# EAGLE design Power Supply Board (EAGLE 9.0.1)
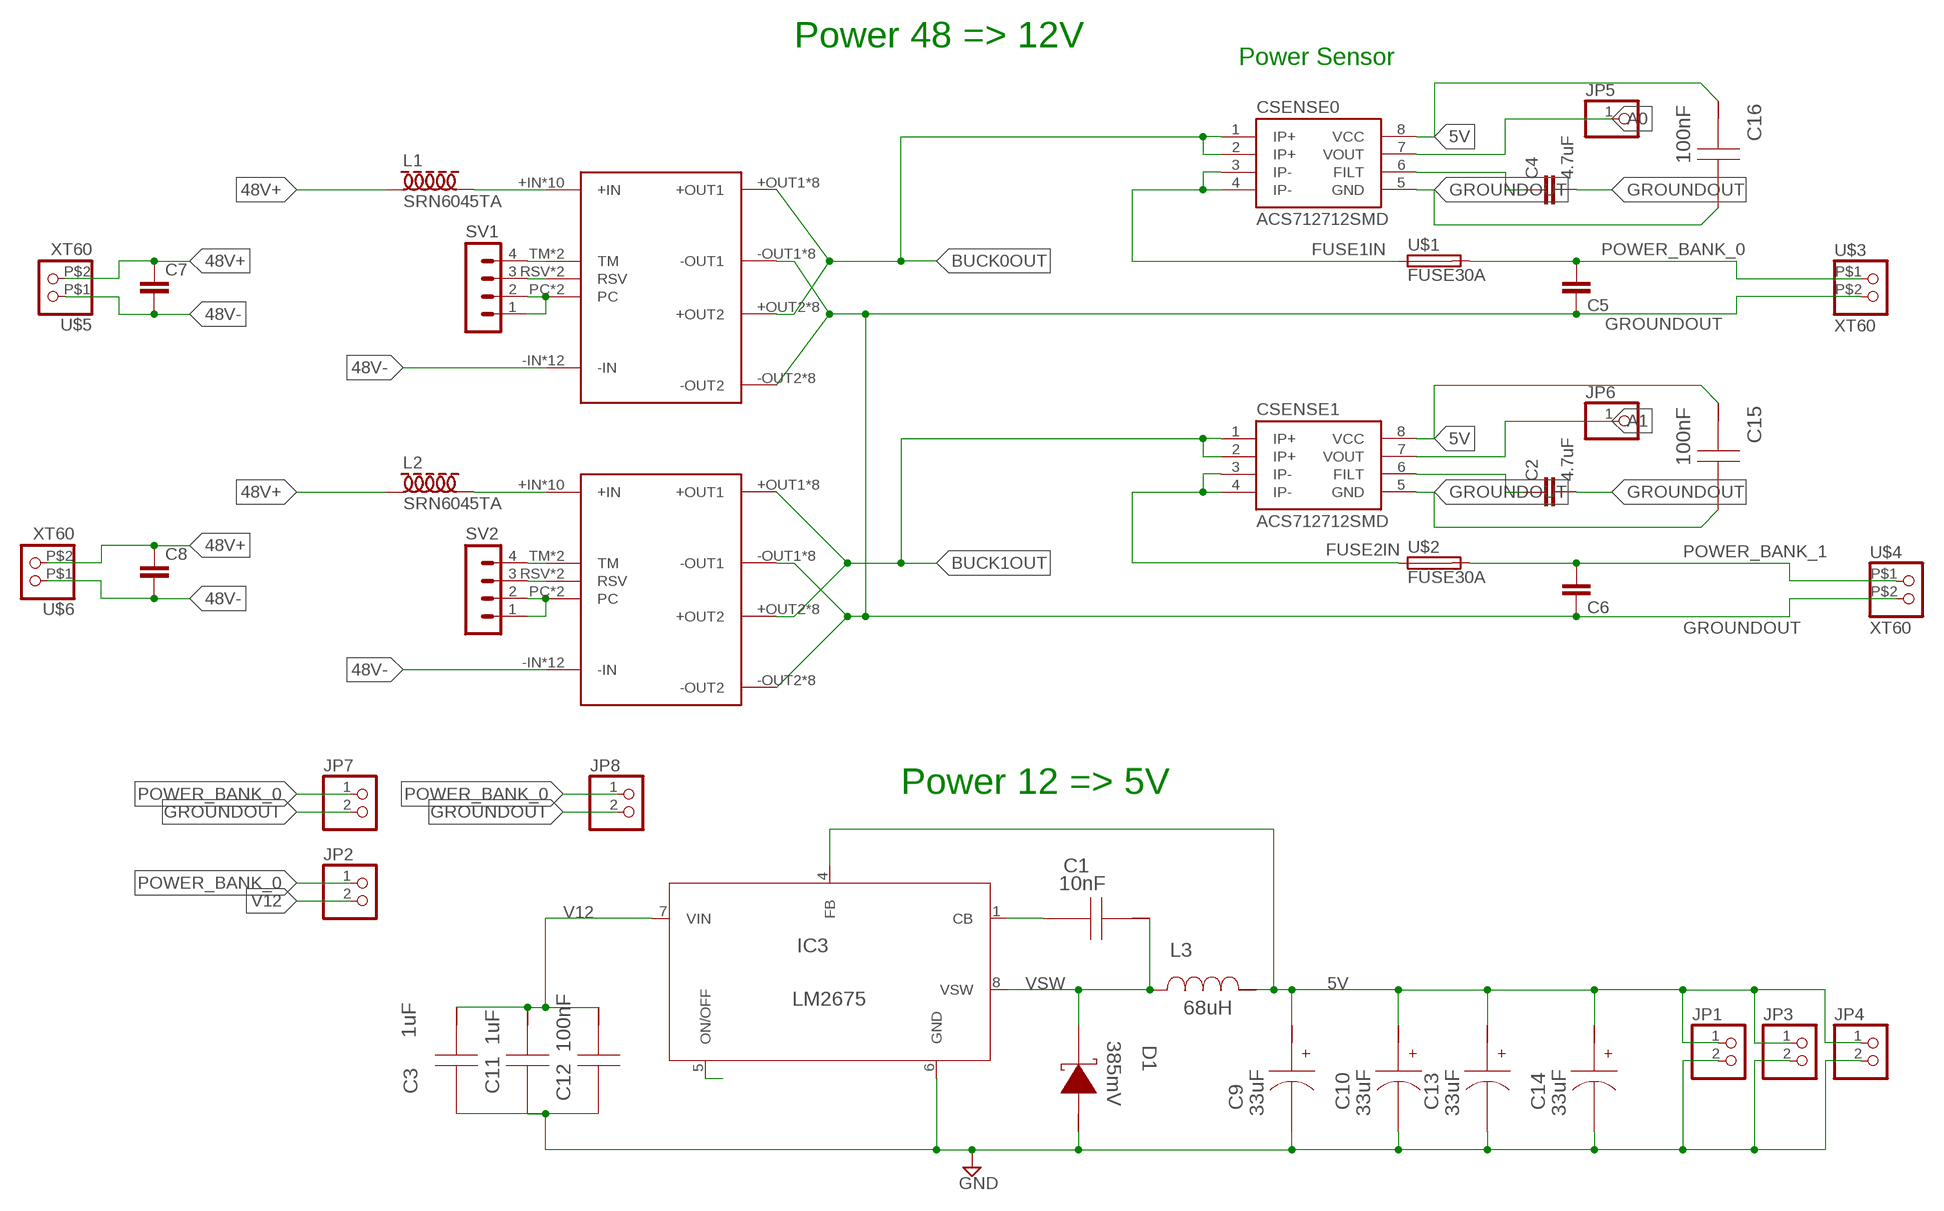
[diagram p0: schematic, sheet 1]

## Parts
C1  10nF  GRM216R71H103KA01D  [0805]
C2  4.7uF  4.7UF-6.3V-10%(0603)0603  [0603-CAP]
C3  1uF  GRM188R61E105KA12D  [0603]
C4  4.7uF  4.7UF-6.3V-10%(0603)0603  [0603-CAP]
C5  C2,5-3  [C2.5-3]
C6  C2,5-3  [C2.5-3]
C7  C2,5-3  [C2.5-3]
C8  C2,5-3  [C2.5-3]
C9  33uF  ATPH33MAHA  [CAPSMT_6_A09]
C10  33uF  ATPH33MAHA  [CAPSMT_6_A09]
C11  1uF  GRM188R61E105KA12D  [0603]
C12  100nF  08053C104KAT2A  [0805]
C13  33uF  ATPH33MAHA  [CAPSMT_6_A09]
C14  33uF  ATPH33MAHA  [CAPSMT_6_A09]
C15  100nF  08053C104KAT2A  [0805]
C16  100nF  08053C104KAT2A  [0805]
CSENSE0  ACS712712SMD  [SO08]
CSENSE1  ACS712712SMD  [SO08]
D1  385mV  MBR0520LT1G  [SOD-123]
IC3  LM2675  LM2675MX-3.3/NOPB  [M08A]
JP1  PINHD-1X2  [1X02]
JP2  PINHD-1X2  [1X02]
JP3  PINHD-1X2  [1X02]
JP4  PINHD-1X2  [1X02]
JP5  PINHD-1X1  [1X01]
JP6  PINHD-1X1  [1X01]
JP7  PINHD-1X2  [1X02]
JP8  PINHD-1X2  [1X02]
L1  SRN6045TA  [SRN6045TA]
L2  SRN6045TA  [SRN6045TA]
L3  68uH  SRU1028-680Y  [SRU1028]
SV1  MA04-1  [MA04-1]
SV2  MA04-1  [MA04-1]
U$1  FUSE30A  [FUSE30A]
U$2  FUSE30A  [FUSE30A]
U$3  XT60  [XT60]
U$4  XT60  [XT60]
U$5  XT60  [XT60]
U$6  XT60  [XT60]
VC1  VOLTAGECONVERTER  [VOLTAGECONVERTER]
VC2  VOLTAGECONVERTER  [VOLTAGECONVERTER]

## Nets
5V: C9.1(+) C10.1(+) C13.1(+) C14.1(+) C15.1 C16.1 CSENSE0.8(VCC) CSENSE1.8(VCC) IC3.4(FB) JP1.1 JP3.1 JP4.1 L3.2
48V+: C7.1 C8.1 L1.P$1 L2.P$1 U$5.P$2 U$6.P$2
48V-: C7.2 C8.2 U$5.P$1 U$6.P$1 VC1.-IN VC1.-IN@0(-IN) VC1.-IN@1(-IN) VC1.-IN@2(-IN) VC1.-IN@3(-IN) VC1.-IN@4(-IN) VC1.-IN@5(-IN) VC1.-IN@6(-IN) VC1.-IN@7(-IN) VC1.-IN@8(-IN) VC1.-IN@9(-IN) VC1.-IN@10(-IN) VC2.-IN VC2.-IN@0(-IN) VC2.-IN@1(-IN) VC2.-IN@2(-IN) VC2.-IN@3(-IN) VC2.-IN@4(-IN) VC2.-IN@5(-IN) VC2.-IN@6(-IN) VC2.-IN@7(-IN) VC2.-IN@8(-IN) VC2.-IN@9(-IN) VC2.-IN@10(-IN)
48VIN1: L1.P$2 VC1.+IN VC1.+IN@1(+IN) VC1.+IN@2(+IN) VC1.+IN@3(+IN) VC1.+IN@4(+IN) VC1.+IN@5(+IN) VC1.+IN@6(+IN) VC1.+IN@7(+IN) VC1.+IN@8(+IN) VC1.+IN@9(+IN)
48VIN2: L2.P$2 VC2.+IN VC2.+IN@1(+IN) VC2.+IN@2(+IN) VC2.+IN@3(+IN) VC2.+IN@4(+IN) VC2.+IN@5(+IN) VC2.+IN@6(+IN) VC2.+IN@7(+IN) VC2.+IN@8(+IN) VC2.+IN@9(+IN)
A0: CSENSE0.7(VOUT) JP5.1
A1: CSENSE1.7(VOUT) JP6.1
BUCK0OUT: CSENSE0.1(IP+) CSENSE0.2(IP+) VC1.+OUT1 VC1.+OUT1@1(+OUT1) VC1.+OUT1@2(+OUT1) VC1.+OUT1@3(+OUT1) VC1.+OUT1@4(+OUT1) VC1.+OUT1@5(+OUT1) VC1.+OUT1@6(+OUT1) VC1.+OUT1@7(+OUT1) VC1.+OUT2 VC1.+OUT2@1(+OUT2) VC1.+OUT2@2(+OUT2) VC1.+OUT2@3(+OUT2) VC1.+OUT2@4(+OUT2) VC1.+OUT2@5(+OUT2) VC1.+OUT2@6(+OUT2) VC1.+OUT2@7(+OUT2)
BUCK1OUT: CSENSE1.1(IP+) CSENSE1.2(IP+) VC2.+OUT1 VC2.+OUT1@1(+OUT1) VC2.+OUT1@2(+OUT1) VC2.+OUT1@3(+OUT1) VC2.+OUT1@4(+OUT1) VC2.+OUT1@5(+OUT1) VC2.+OUT1@6(+OUT1) VC2.+OUT1@7(+OUT1) VC2.+OUT2 VC2.+OUT2@1(+OUT2) VC2.+OUT2@2(+OUT2) VC2.+OUT2@3(+OUT2) VC2.+OUT2@4(+OUT2) VC2.+OUT2@5(+OUT2) VC2.+OUT2@6(+OUT2) VC2.+OUT2@7(+OUT2)
CB: C1.2 IC3.1(CB)
FILT1: C4.1 CSENSE0.6(FILT)
FILT2: C2.1 CSENSE1.6(FILT)
FUSE1IN: CSENSE0.3(IP-) CSENSE0.4(IP-) U$1.P$1 U$1.P$2
FUSE2IN: CSENSE1.3(IP-) CSENSE1.4(IP-) U$2.P$1 U$2.P$2
GROUNDOUT: C2.2 C3.2 C4.2 C5.1 C6.1 C9.2(-) C10.2(-) C11.2 C12.2 C13.2(-) C14.2(-) C15.2 C16.2 CSENSE0.5(GND) CSENSE1.5(GND) D1.2(A) IC3.6(GND) JP1.2 JP3.2 JP4.2 JP7.2 JP8.2 U$3.P$2 U$4.P$2 VC1.-OUT1 VC1.-OUT1@1(-OUT1) VC1.-OUT1@2(-OUT1) VC1.-OUT1@3(-OUT1) VC1.-OUT1@4(-OUT1) VC1.-OUT1@5(-OUT1) VC1.-OUT1@6(-OUT1) VC1.-OUT1@7(-OUT1) VC1.-OUT2 VC1.-OUT2@1(-OUT2) VC1.-OUT2@2(-OUT2) VC1.-OUT2@3(-OUT2) VC1.-OUT2@4(-OUT2) VC1.-OUT2@5(-OUT2) VC1.-OUT2@6(-OUT2) VC1.-OUT2@7(-OUT2) VC2.-OUT1 VC2.-OUT1@1(-OUT1) VC2.-OUT1@2(-OUT1) VC2.-OUT1@3(-OUT1) VC2.-OUT1@4(-OUT1) VC2.-OUT1@5(-OUT1) VC2.-OUT1@6(-OUT1) VC2.-OUT1@7(-OUT1) VC2.-OUT2 VC2.-OUT2@1(-OUT2) VC2.-OUT2@2(-OUT2) VC2.-OUT2@3(-OUT2) VC2.-OUT2@4(-OUT2) VC2.-OUT2@5(-OUT2) VC2.-OUT2@6(-OUT2) VC2.-OUT2@7(-OUT2) ; supply symbol labelled GND
N$2: SV1.3 VC1.RSV VC1.RSV@1(RSV)
N$5: SV2.3 VC2.RSV VC2.RSV@1(RSV)
N$7: IC3.5(ON/OFF)
PC1: SV1.1 SV1.2 SV2.1 SV2.2 VC1.PC VC1.PC21(PC) VC2.PC VC2.PC21(PC)
POWER_BANK_0: C5.2 JP2.1 JP7.1 JP8.1 U$1.P$3 U$1.P$4 U$3.P$1
POWER_BANK_1: C6.2 U$2.P$3 U$2.P$4 U$4.P$1
TM1: SV1.4 VC1.TM VC1.TM@1(TM)
TM2: SV2.4 VC2.TM VC2.TM@1(TM)
V12: C3.1 C11.1 C12.1 IC3.7(VIN) JP2.2
VSW: C1.1 D1.1(K) IC3.8(VSW) L3.1

## Notes on the sheet
- Power 48 => 12V
- Power Sensor
- Power 12 => 5V

## Library data of the parts
C1 = buck33:GRM216R71H103KA01D; CAP: 1.0E-8; ESR: 0.0; IRMS: 0.0; MANUFACTURER_NAME: MuRata; MANUFACTURER_PART_NUMBER: GRM216R71H103KA01D; VDC: 50.0; VENDOR: MuRata
C2 C4 = SparkFun-Capacitors:4.7UF-6.3V-10%(0603): CAP-08280; PROD_ID: CAP-08280
C3 C11 = buck33:GRM188R61E105KA12D; CAP: 1.0E-6; ESR: 0.0; IRMS: 0.0; MANUFACTURER_NAME: MuRata; MANUFACTURER_PART_NUMBER: GRM188R61E105KA12D; VDC: 25.0; VENDOR: MuRata
C5-C8 = capacitor-wima:C: CAPACITOR naming: grid - package width
C9 C10 C13 C14 = buck33:ATPH33MAHA; CAP: 3.3E-5; DATASHEETURL: http://industrial.panasonic.com/www%2Ddata/pdf/AAA8000/AAA8000CE2.pdf; ESR: 0.15; IRMS: 0.51; MANUFACTURER_NAME: Panasonic; MANUFACTURER_PART_NUMBER: ATPH33MAHA; VDC: 10.0; VENDOR: Panasonic
C12 C15 C16 = buck33:08053C104KAT2A; CAP: 1.0E-7; ESR: 0.28; IRMS: 0.0; MANUFACTURER_NAME: AVX; MANUFACTURER_PART_NUMBER: 08053C104KAT2A; VDC: 25.0; VENDOR: AVX
CSENSE0 CSENSE1 = SparkFun-AnalogIC:ACS712: Hall-effect-based isolated linear current sensor; PROD_ID: IC-08964
D1 = buck33:MBR0520LT1G; DATASHEETURL: http://www.onsemi.com/pub%5Flink/Collateral/MBR0520LT1%2DD.PDF; IO: 0.5; MANUFACTURER_NAME: ON Semiconductor; MANUFACTURER_PART_NUMBER: MBR0520LT1G; VENDOR: ON Semiconductor; VFATIO: 0.385; VRRM: 20.0
IC3 = buck33:LM2675MX-3.3/NOPB; DATASHEETURL: http://www.ti.com/product/lm2675; FREQUENCY: 260000.0; IMAX: 1.0; MANUFACTURER_NAME: Texas Instruments; MANUFACTURER_PART_NUMBER: LM2675MX-3.3/NOPB; MKTG_PACKAGE: NA; NSID: LM2675N-5.0/NOPB; PACKAGE: NA; VENDOR: Texas Instruments
JP1-JP4 JP7 JP8 = pinhead:PINHD-1X2: PIN HEADER
JP5 JP6 = adafruit:PINHD-1X1: Pin header 1x1 for 0.1" spacing With round pins
L1 L2 = HostlerLib:SRN6045TA
L3 = buck33:SRU1028-680Y; DCR: 0.23; IDC: 1.0; L: 6.8E-5; MANUFACTURER_NAME: Bourns; MANUFACTURER_PART_NUMBER: SRU1028-680Y; VENDOR: Bourns
SV1 SV2 = con-lstb:MA04-1: PIN HEADER; OC_FARNELL: unknown; OC_NEWARK: unknown
U$1 U$2 = HostlerLib:FUSE30A
U$3-U$6 = HostlerLib:XT60
VC1 VC2 = Voltage Converter Pins:VOLTAGECONVERTER

## Board
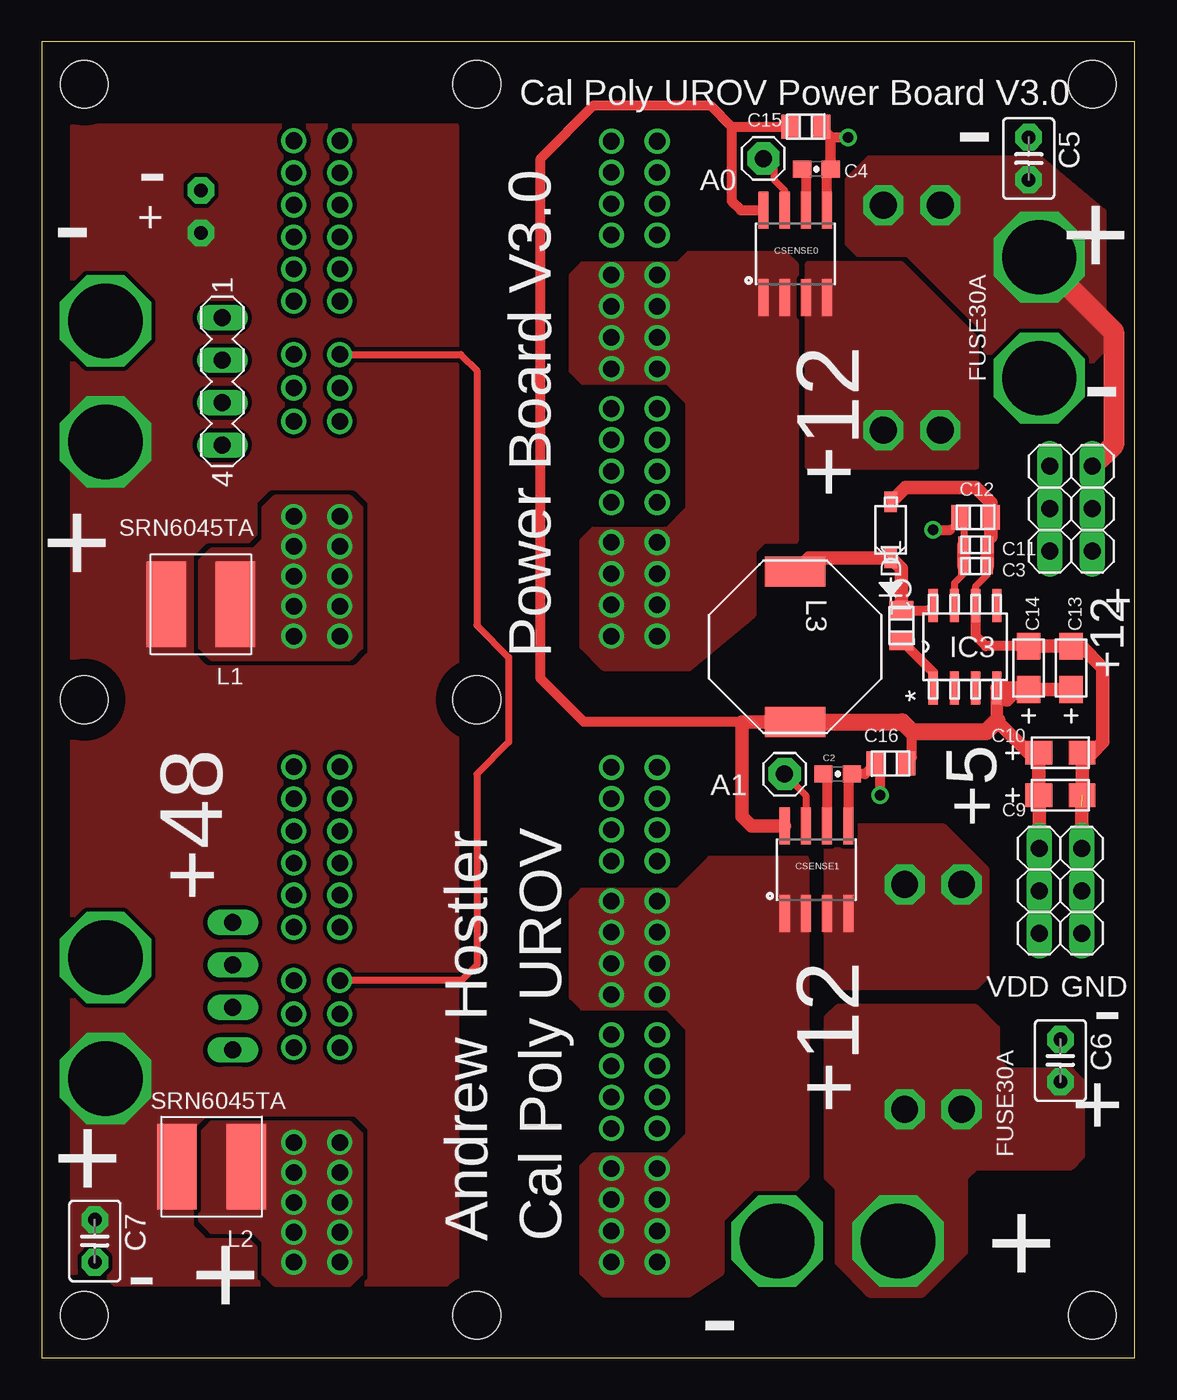
[diagram p1: board, top side]
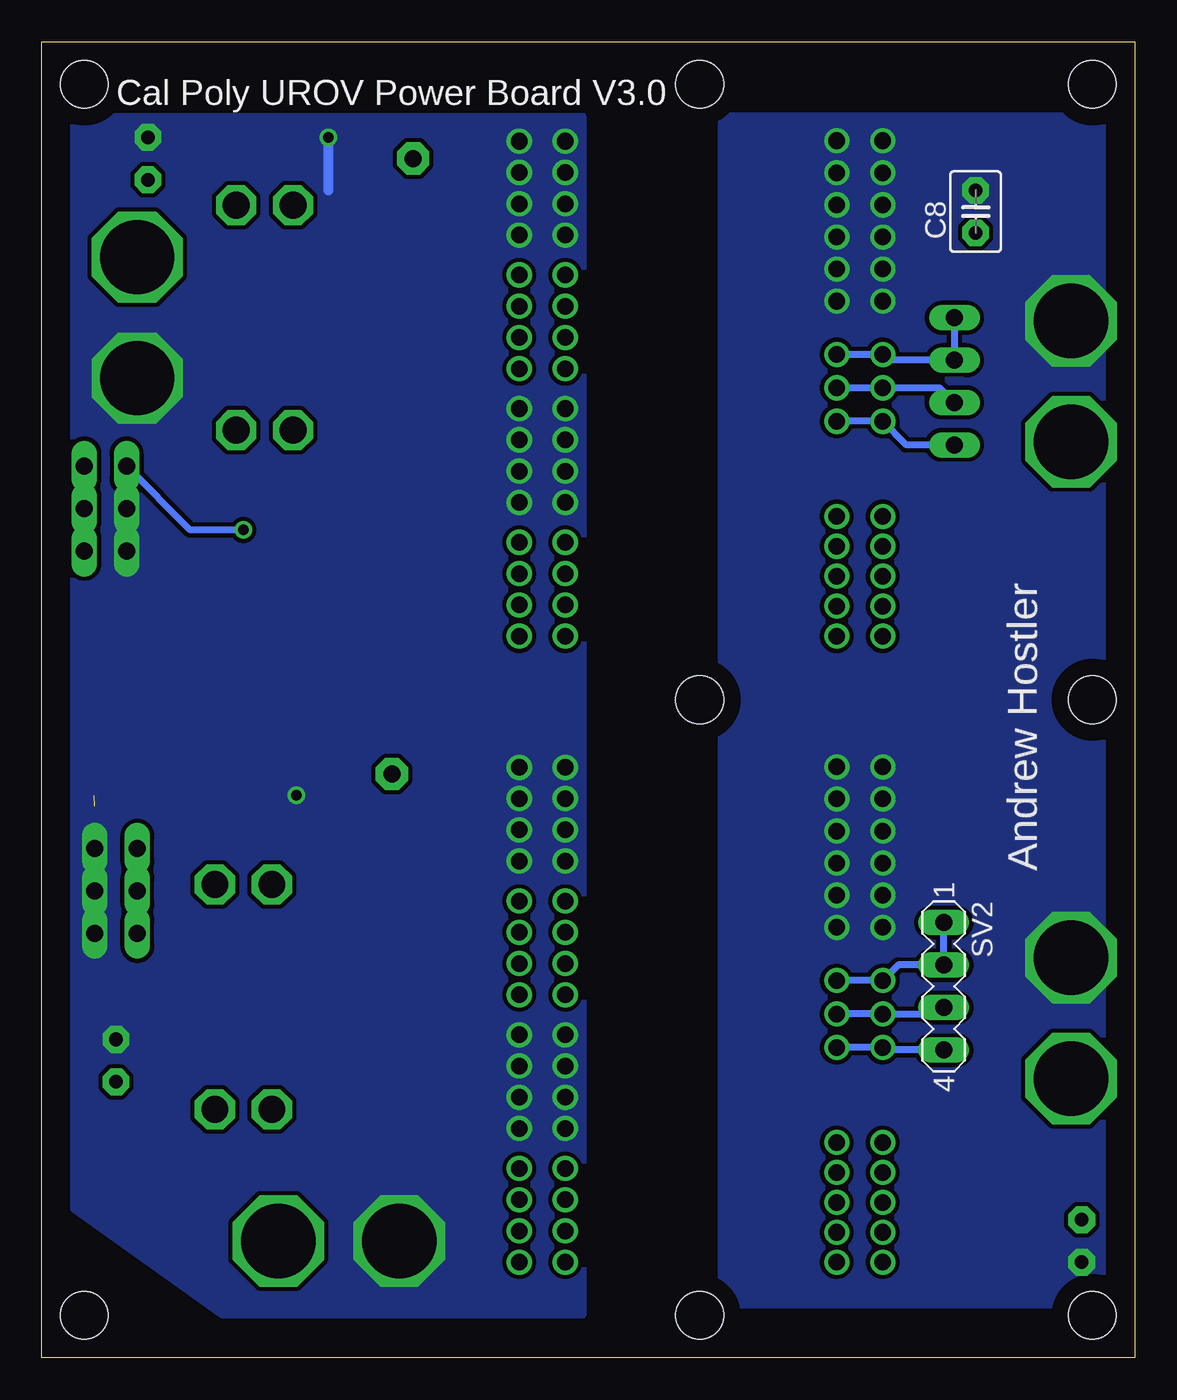
[diagram p2: board, bottom side, seen from below]

Size 65.41 x 78.74 mm. Coordinates in mm from the lower left corner, seen from the top.
Outline: 0,0 65.41,0 65.41,78.74 0,78.74 0,0
Copper layers (1*16): Top 0.035mm / dielectric 1.5mm / Bottom 0.035mm
Design rules "default *": minimum track width 10mil, minimum drill 24mil, track to track 10mil, track to pad 20mil, pad to pad 8mil, via to via 8mil, smd to smd 8mil, copper to edge 40mil, drill to drill 8mil, minimum pad ring 10mil, minimum via ring 8mil, stop-mask expansion 4mil, vias tented up to drill 0mil, thermal gap 10mil
Holes 2.84 mm at 26.04,2.54 26.04,39.37 26.04,76.2 2.54,76.2 62.87,76.2 62.87,2.54 2.54,2.54 2.54,39.37

### Footprints (pad centres in the part's own frame; a part is rotated, then mirrored left to right if it is on the bottom)
0805 = smd 1.118 x 1.448: 1 -0.902,0; 2 0.902,0
0603-CAP = smd 1.1 x 1: 1 -0.85,0; 2 0.85,0
0603 = smd 0.66 x 0.965: 1 -0.699,0; 2 0.699,0
C2.5-3 = drill 0.813 pad 1.6 octagon: 1 -1.27,0; 2 1.27,0
CAPSMT_6_A09 = smd 1.6 x 1.397: 1 -1.295,0; 2 1.295,0
SO08 = smd 0.61 x 2.21: 1 -1.905,-2.616; 2 -0.635,-2.616; 3 0.635,-2.616; 4 1.905,-2.616; 5 1.905,2.616; 6 0.635,2.616; 7 -0.635,2.616; 8 -1.905,2.616
SOD-123 = smd 1.219 x 0.762: 1 -1.676,0; 2 1.676,0
M08A = smd 1.981 x 0.559: 1 -2.464,1.905; 2 -2.464,0.635; 3 -2.464,-0.635; 4 -2.464,-1.905; 5 2.464,-1.905; 6 2.464,-0.635; 7 2.464,0.635; 8 2.464,1.905
1X02 = drill 1.016 long: 1 -1.27,0; 2 1.27,0
1X01 = drill 1.016 pad 1.93 octagon: 1 0,0
SRN6045TA = smd 5.105 x 2.362: P$1 0,2.07; P$2 0,-2.07
SRU1028 = smd 1.803 x 3.607: 1 -4.496,0; 2 4.496,0
MA04-1 = drill 1.016 long: 1 -3.81,0; 2 -1.27,0; 3 1.27,0; 4 3.81,0
FUSE30A = drill 1.6 octagon: P$1 -6.731,1.702; P$2 -6.731,-1.702; P$3 6.731,1.702; P$4 6.731,-1.702
XT60 = drill 4.445 octagon: P$1 -3.619,0; P$2 3.619,0
VOLTAGECONVERTER = drill 0.99 pad 1.5: +IN -19,0; +IN@1 -19,-1.79; +IN@2 -19,-3.58; +IN@3 -19,-5.37; +IN@4 -19,-7.16; +IN@5 -21.75,0; +IN@6 -21.75,-1.79; +IN@7 -21.75,-3.58; +IN@8 -21.75,-5.37; +IN@9 -21.75,-7.16; +OUT1 0,0; +OUT1@1 0,-1.87; +OUT1@2 0,-3.74; +OUT1@3 0,-5.61; +OUT1@4 -2.75,0; +OUT1@5 -2.75,-1.87; +OUT1@6 -2.75,-3.74; +OUT1@7 -2.75,-5.61; +OUT2 0,-16; +OUT2@1 0,-17.87; +OUT2@2 0,-19.74; +OUT2@3 0,-21.61; +OUT2@4 -2.75,-16; +OUT2@5 -2.75,-17.87; +OUT2@6 -2.75,-19.74; +OUT2@7 -2.75,-21.61; -IN -19,-20.04; -IN@0 -21.75,-27.72; -IN@1 -19,-21.96; -IN@2 -19,-23.88; -IN@3 -19,-25.8; -IN@4 -19,-27.72; -IN@5 -19,-29.64; -IN@6 -21.75,-20.04; -IN@7 -21.75,-21.96; -IN@8 -21.75,-23.88; -IN@9 -21.75,-25.8; -IN@10 -21.75,-29.64; -OUT1 0,-8; -OUT1@1 0,-9.87; -OUT1@2 0,-11.74; -OUT1@3 0,-13.61; -OUT1@4 -2.75,-8; -OUT1@5 -2.75,-9.87; -OUT1@6 -2.75,-11.74; -OUT1@7 -2.75,-13.61; -OUT2 0,-24; -OUT2@1 0,-25.87; -OUT2@2 0,-27.74; -OUT2@3 0,-29.61; -OUT2@4 -2.75,-24; -OUT2@5 -2.75,-25.87; -OUT2@6 -2.75,-27.74; -OUT2@7 -2.75,-29.61; PC -21.75,-16.85; PC21 -19,-16.85; RSV -21.75,-14.85; RSV@1 -19,-14.85; TM -21.75,-12.85; TM@1 -19,-12.85

### Placement (x,y rotation side)
C1  51.44,43.81 270 top
C2  47.62,34.92 0 top
C3  55.88,47.37 0 top
C4  46.35,71.12 0 top
C5  59.05,71.75 270 top
C6  60.96,17.78 270 top
C7  3.17,6.99 270 top
C8  9.53,68.58 90 bottom
C9  60.96,33.66 0 top
C10  60.96,36.2 0 top
C11  55.88,48.64 0 top
C12  55.88,50.29 0 top
C13  61.59,41.27 90 top
C14  59.05,41.27 90 top
C15  45.72,73.66 0 top
C16  50.8,35.56 180 top
CSENSE0  45.09,66.04 0 top
CSENSE1  46.35,29.21 0 top
D1  50.8,49.53 90 top
IC3  55.24,42.55 90 top
JP1  60.96,30.48 0 top
JP2  61.59,53.34 180 top
JP3  60.96,27.94 0 top
JP4  60.96,25.4 0 top
JP5  43.18,71.75 0 top
JP6  44.45,34.92 0 top
JP7  61.59,50.8 180 top
JP8  61.59,48.26 180 top
L1  9.53,45.09 90 top
L2  10.16,11.43 90 top
L3  45.09,42.55 270 top
SV1  10.79,58.42 270 top
SV2  11.43,22.23 270 bottom
U$1  52.07,62.23 90 top
U$2  53.34,21.59 270 top
U$3  59.69,62.23 270 top
U$4  47.62,6.99 180 top
U$5  3.81,20.32 270 top
U$6  3.81,58.42 270 bottom
VC1  36.83,43.18 180 bottom
VC2  36.83,5.71 180 bottom

### Tracks (layer width: path | path; a pad name or v marks a point on that pad's centre or on a via)
5V
  Top 0.406: 59.05,36.2 C10.1 | C9.1 59.69,33.63
  Top 0.61: 41.91,38.05 32.44,38.05 29.84,40.64 29.84,71.75 33.02,74.93 40.01,74.93 41.27,73.66 | 41.27,73.66 41.27,69.22 41.83,68.66 CSENSE0.8 | C16.1 52.07,35.93 52.07,37.47 | 41.27,73.66 C15.1
  Top 0.762: 57.15,38.1 IC3.4
  Top 0.813: C13.1 C14.1 59.03,40.01 58.42,40.01 57.76,39.34 57.76,39.47 IC3.4 58.98,40.08 59.05,40.01 | C10.1 C9.1 | L3.2 41.91,38.05 41.91,32.38 42.47,31.83 CSENSE1.8 | JP4.1 JP3.1 JP1.1 59.69,33.63 | 57.15,38.1 59.05,36.2
  Top 1.016: L3.2 51.49,38.05 52.07,37.47 56.52,37.47 57.15,38.1
48V+
  pour Top (rank 3, no thermals): 1.91,73.66 24.77,73.66 24.77,4.45 1.91,4.45
48V-
  pour Bottom (no thermals): 1.91,74.3 24.77,74.3 24.77,3.17 1.91,3.17
48VIN1
  pour Top (no thermals): 13.34,50.8 13.34,48.9 12.7,48.26 10.16,48.26 9.53,47.62 9.53,42.55 10.16,41.91 18.41,41.91 19.05,42.55 19.05,50.8 18.41,51.44 13.97,51.44
48VIN2
  pour Top (no thermals): 9.53,13.34 9.53,8.26 10.16,7.62 12.7,7.62 13.34,6.99 13.34,5.08 13.97,4.45 18.41,4.45 19.05,5.08 19.05,13.34 18.41,13.97 10.16,13.97
A0
  Top 0.406: JP5.1 43.81,71.12 43.81,70.48 44.45,69.85 CSENSE0.7
A1
  Top 0.406: JP6.1 45.72,33.66 CSENSE1.7
BUCK0OUT
  pour Top (no thermals): 33.66,41.27 32.38,42.55 32.38,48.9 33.02,49.53 37.47,49.53 38.73,50.8 38.73,57.15 37.47,58.42 32.38,58.42 31.75,59.05 31.75,64.77 32.38,65.41 38.1,65.41 38.73,66.04 44.45,66.04 45.09,65.41 45.09,48.9 43.18,48.9 42.55,48.26 42.55,44.45 38.73,41.27
BUCK1OUT
  pour Top (no thermals): 33.66,3.81 32.38,5.08 32.38,11.43 33.02,12.06 37.47,12.06 38.73,13.34 38.73,19.68 37.47,20.95 32.38,20.95 31.75,21.59 31.75,27.3 32.38,27.94 38.1,27.94 40.01,29.84 45.72,29.84 45.72,10.79 45.09,10.16 42.55,10.16 40.64,8.26 40.64,5.08 38.73,3.81
CB
  Top 0.61: IC3.1 53.34,41.01 C1.2
FILT1
  Top 0.61: C4.1 45.72,70.91 CSENSE0.6
FILT2
  Top 0.61: C2.1 46.99,34.71 CSENSE1.6
FUSE1IN
  pour Top (no thermals): 45.85,65.41 45.85,53.34 55.88,53.34 55.88,60.96 51.44,65.41
FUSE2IN
  pour Top (no thermals): 46.99,31.11 46.99,22.86 47.62,22.23 55.88,22.23 56.52,22.86 56.52,29.21 53.98,31.75 47.62,31.75
GROUNDOUT  (via drill 0.64)  (1 unrouted)
  Top 0.406: IC3.6 55.88,46.16 56.58,46.86 C3.2 | C11.2 56.78,48.84 56.78,49.1 | C16.2 50.16,35.56
  Top 0.61: C14.2 56.49,42.57 55.88,43.18 IC3.6 | C2.2 48.26,34.71 CSENSE1.5 | 48.63,34.92 C2.2 | C4.2 46.99,70.91 | C4.2 47.2,73.08 C15.2 | C4.2 47.2,73.03 v48.26,73.03 | CSENSE0.5 46.99,71.12 C4.2 | C16.2 49.26,34.92 C2.2 | 50.16,35.93 50.16,35.56 v50.16,33.66
  Top 0.813: C14.2 C13.2 62.2,42.57 63.5,41.27 63.5,36.83 62.87,36.2 C10.2 C9.2 | 56.78,49.1 C12.2 56.78,51.17 55.88,52.07 51.66,52.07 D1.2 | C11.2 C3.2 | JP4.2 JP3.2 JP1.2 62.23,33.02
  Bottom 0.61: v48.26,73.03 48.26,69.85
  pour Bottom (no thermals): 63.5,74.3 33.02,74.3 33.02,2.54 54.61,2.54 63.5,8.89
N$2
  Bottom 0.406: VC1.RSV@1 VC1.RSV 11.68,58.03 SV1.3
N$5
  Bottom 0.406: VC2.RSV@1 VC2.RSV 11.43,20.57 SV2.3
PC1
  Top 0.406: VC1.PC21 25.06,60.03 26.04,59.05 26.04,43.81 27.94,41.91 27.94,36.83 26.04,34.92 26.04,23.5 25.11,22.57 VC2.PC21
  Bottom 0.406: SV1.1 SV1.2 14.74,59.69 VC1.PC VC1.PC21 | VC2.PC21 VC2.PC 14.15,23.5 SV2.2 SV2.1
POWER_BANK_0
  Top 1.27: U$3.P$1 64.14,61.4 64.14,54.61 JP2.1 JP7.1 JP8.1
  pour Top (rank 4, no thermals): 49.53,71.75 59.69,71.75 63.5,68.58 63.5,60.33 62.87,59.69 57.15,59.69 51.44,65.41 49.53,65.41 48.26,66.67 48.26,70.48
POWER_BANK_1
  pour Top (no thermals): 46.99,20.32 46.99,10.79 47.62,10.16 47.62,5.71 49.53,3.81 52.7,3.81 55.24,6.35 55.24,10.79 55.88,11.43 61.59,11.43 62.23,12.06 62.23,16.51 61.59,17.14 57.78,17.14 57.15,17.78 57.15,19.68 55.88,20.95 47.62,20.95
TM1
  Bottom 0.406: SV1.4 13.66,54.61 VC1.TM VC1.TM@1
TM2
  Bottom 0.406: VC2.TM@1 VC2.TM 15.08,18.41 SV2.4
V12  (via drill 0.64)
  Top 0.406: C3.1 55.18,46.93 54.61,46.35 IC3.7 | 54.34,49.53 54.98,50.16 C12.1 55.18,50.09 C11.1
  Top 0.61: v53.34,49.53 54.34,49.53
  Top 0.813: C11.1 C3.1
  Bottom 0.406: v53.34,49.53 56.52,49.53 JP2.2
VSW
  Top 0.61: C1.1 53.05,44.72 IC3.8
  Top 0.813: C1.1 51.44,47.22 D1.1 45.9,47.85 L3.1

### Text on the board
tPlace: Cal Poly UROV Power Board V3.0 | +12 | + | Power Board V3.0 | +12 | +5 | +48 | +12 | Andrew Hostler | Cal Poly UROV
bPlace: Cal Poly UROV Power Board V3.0 | Andrew Hostler
tNames: - | A0 | - | + | - | + | - | + | A1 | VDD | GND | - | + | + | + | - | + | -